# EAGLE schematic clock12 (EAGLE 7.7.0)

## Sheet 1 of 3
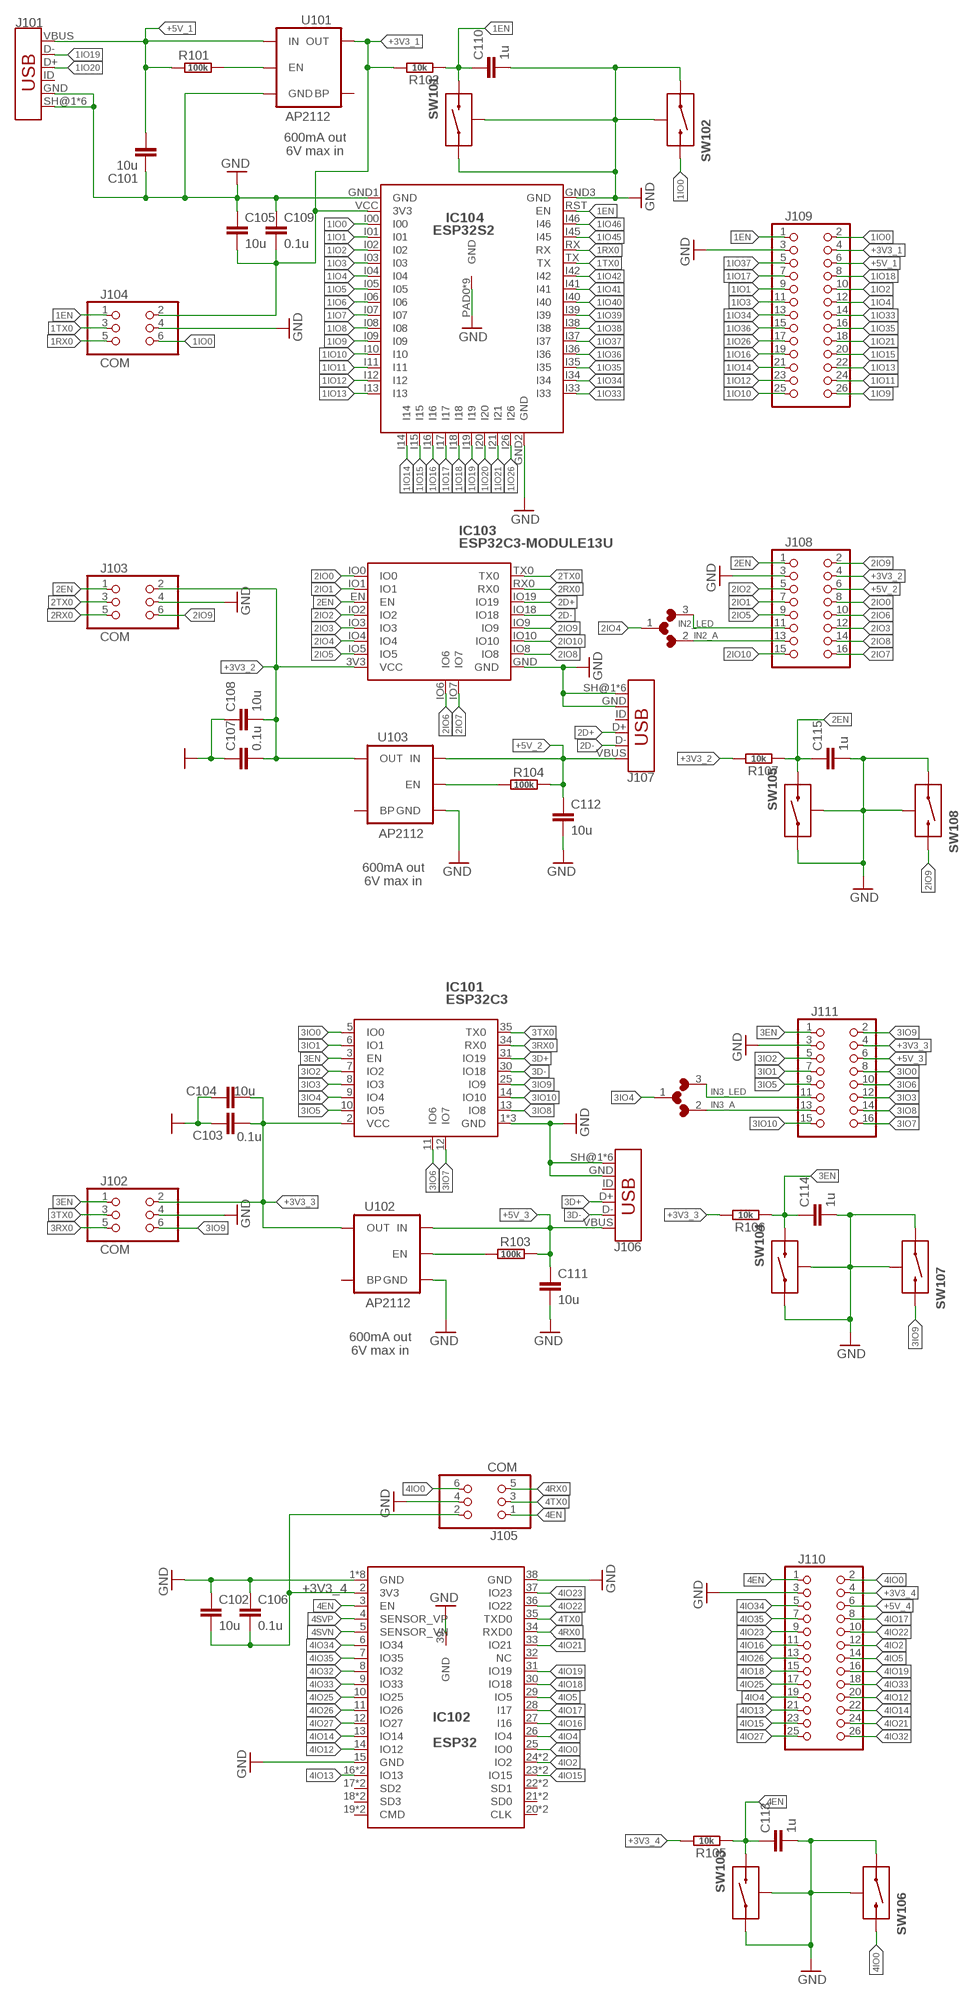
[diagram p0: schematic, sheet 1]

### Parts
C101  10u  CAP0603-CAP  [0603-CAP]
C102  10u  CAP0603-CAP  [0603-CAP]
C103  0.1u  CAP0603-CAP  [0603-CAP]
C104  10u  CAP0603-CAP  [0603-CAP]
C105  10u  CAP0603-CAP  [0603-CAP]
C106  0.1u  CAP0603-CAP  [0603-CAP]
C107  0.1u  CAP0603-CAP  [0603-CAP]
C108  10u  CAP0603-CAP  [0603-CAP]
C109  0.1u  CAP0603-CAP  [0603-CAP]
C110  1u  CAP0603-CAP  [0603-CAP]
C111  10u  CAP0603-CAP  [0603-CAP]
C112  10u  CAP0603-CAP  [0603-CAP]
C113  1u  CAP0603-CAP  [0603-CAP]
C114  1u  CAP0603-CAP  [0603-CAP]
C115  1u  CAP0603-CAP  [0603-CAP]
IC101  ESP32C3  ESP32C3-MODULE32S  [ESP32C3-S]
IC102  ESP32  ESP32-MODULEDUAL  [ESP32-WROOVER/WROOM]
IC103  ESP32C3-MODULE13U  [ESP32C3-13U]
IC104  ESP32S2  ESP32S2-MODULEAI  [ESP-12K]
J101  USB_MICRO-BFEMALE_SMT_  [USB-B-MICRO-SMD_MY]
J102  COM  HEADER-2X3SMT  [2X03_SMT]
J103  COM  HEADER-2X3SMT  [2X03_SMT]
J104  COM  HEADER-2X3SMT  [2X03_SMT]
J105  COM  HEADER-2X3SMT  [2X03_SMT]
J106  USB_MICRO-BFEMALE_SMT_  [USB-B-MICRO-SMD_MY]
J107  USB_MICRO-BFEMALE_SMT_  [USB-B-MICRO-SMD_MY]
J108  HEADER-2X8  [2X8]
J109  HEADER-2X13  [2X13]
J110  HEADER-2X13  [2X13]
J111  HEADER-2X8  [2X8]
R101  100k  R-EU_R0603  [R0603]
R102  10k  R-EU_R0603  [R0603]
R103  100k  R-EU_R0603  [R0603]
R104  100k  R-EU_R0603  [R0603]
R105  10k  R-EU_R0603  [R0603]
R106  10k  R-EU_R0603  [R0603]
R107  10k  R-EU_R0603  [R0603]
SJ101  L/W  MICROBUILDER_SOLDERJUMPER3  [MICROBUILDER_SOLDERJUMPER_ARROW_NOPASTE_3]
SJ102  L/W  MICROBUILDER_SOLDERJUMPER3  [MICROBUILDER_SOLDERJUMPER_ARROW_NOPASTE_3]
SW101  RST  MICROSWITCH-BUTTON  [MICROPUSH-BUT_TOP]
SW102  PRG  MICROSWITCH-BUTTON  [MICROPUSH-BUT_TOP]
SW103  RST  MICROSWITCH-BUTTON  [MICROPUSH-BUT_TOP]
SW104  RST  MICROSWITCH-BUTTON  [MICROPUSH-BUT_TOP]
SW105  RST  MICROSWITCH-BUTTON  [MICROPUSH-BUT_TOP]
SW106  PRG  MICROSWITCH-BUTTON  [MICROPUSH-BUT_TOP]
SW107  PRG  MICROSWITCH-BUTTON  [MICROPUSH-BUT_TOP]
SW108  PRG  MICROSWITCH-BUTTON  [MICROPUSH-BUT_TOP]
U101  AP2112  V_REG_LDOSMD  [SOT23-5]
U102  AP2112  V_REG_LDOSMD  [SOT23-5]
U103  AP2112  V_REG_LDOSMD  [SOT23-5]

### Nets
1EN: C110.1 IC104.RST(EN) J104.1 J109.1 R102.1 SW101.B
1EN_P: R101.2 U101.3(EN)
1IO0: IC104.I00 J104.6 J109.2 SW102.B
1IO1: IC104.I01 J109.9
1IO2: IC104.I02 J109.10
1IO3: IC104.I03 J109.11
1IO4: IC104.I04 J109.12
1IO5: IC104.I05
1IO6: IC104.I06
1IO7: IC104.I07
1IO8: IC104.I08
1IO9: IC104.I09 J109.26
1IO10: IC104.I10 J109.25
1IO11: IC104.I11 J109.24
1IO12: IC104.I12 J109.23
1IO13: IC104.I13 J109.22
1IO14: IC104.I14 J109.21
1IO15: IC104.I15 J109.20
1IO16: IC104.I16 J109.19
1IO17: IC104.I17 J109.7
1IO18: IC104.I18 J109.8
1IO19: IC104.I19 J101.D-
1IO20: IC104.I20 J101.D+
1IO21: IC104.I21 J109.18
1IO26: IC104.I26 J109.17
1IO33: IC104.I33 J109.14
1IO34: IC104.I34 J109.13
1IO35: IC104.I35 J109.16
1IO36: IC104.I36 J109.15
1IO37: IC104.I37 J109.5
1IO38: IC104.I38
1IO39: IC104.I39
1IO40: IC104.I40
1IO41: IC104.I41
1IO42: IC104.I42
1IO45: IC104.I45
1IO46: IC104.I46
1RX0: IC104.RX J104.5
1TX0: IC104.TX J104.3
2D+: IC103.IO19 J107.D+
2D-: IC103.IO18 J107.D-
2EN: C115.1 IC103.EN J103.1 J108.1 R107.1 SW105.B
2EN_P: R104.2 U103.3(EN)
2IO0: IC103.IO0 J108.8
2IO1: IC103.IO1 J108.7
2IO2: IC103.IO2 J108.5
2IO3: IC103.IO3 J108.12
2IO4: IC103.IO4 SJ101.1
2IO5: IC103.IO5 J108.9
2IO6: IC103.IO6 J108.10
2IO7: IC103.IO7 J108.16
2IO8: IC103.IO8 J108.14
2IO9: IC103.IO9 J103.6 J108.2 SW108.B
2IO10: IC103.IO10 J108.15
2RX0: IC103.RX0 J103.5
2TX0: IC103.TX0 J103.3
3D+: IC101.31(IO19) J106.D+
3D-: IC101.30(IO18) J106.D-
3EN: C114.1 IC101.3(EN) J102.1 J111.1 R106.1 SW104.B
3EN_P: R103.2 U102.3(EN)
3IO0: IC101.5(IO0) J111.8
3IO1: IC101.6(IO1) J111.7
3IO2: IC101.7(IO2) J111.5
3IO3: IC101.8(IO3) J111.12
3IO4: IC101.9(IO4) SJ102.1
3IO5: IC101.10(IO5) J111.9
3IO6: IC101.11(IO6) J111.10
3IO7: IC101.12(IO7) J111.16
3IO8: IC101.13(IO8) J111.14
3IO9: IC101.25(IO9) J102.6 J111.2 SW107.B
3IO10: IC101.14(IO10) J111.15
3RX0: IC101.34(RX0) J102.5
3TX0: IC101.35(TX0) J102.3
4EN: C113.1 IC102.3(EN) J105.1 J110.1 R105.1 SW103.B
4IO0: IC102.25(IO0) J105.6 J110.2 SW106.B
4IO2: IC102.24(IO2) IC102.48(IO2) J110.12
4IO4: IC102.26(IO4) J110.19
4IO5: IC102.29(IO5) J110.14
4IO12: IC102.14(IO12) J110.20
4IO13: IC102.16(IO13) IC102.40(IO13) J110.21
4IO14: IC102.13(IO14) J110.22
4IO15: IC102.23(IO15) IC102.47(IO15) J110.23
4IO16: IC102.27(I16) J110.11
4IO17: IC102.28(I17) J110.8
4IO18: IC102.30(IO18) J110.15
4IO19: IC102.31(IO19) J110.16
4IO21: IC102.33(IO21) J110.24
4IO22: IC102.36(IO22) J110.10
4IO23: IC102.37(IO23) J110.9
4IO25: IC102.10(IO25) J110.17
4IO26: IC102.11(IO26) J110.13
4IO27: IC102.12(IO27) J110.25
4IO32: IC102.8(IO32) J110.26
4IO33: IC102.9(IO33) J110.18
4IO34: IC102.6(IO34) J110.5
4IO35: IC102.7(IO35) J110.7
4RX0: IC102.34(RXD0) J105.5
4SVN: IC102.5(SENSOR_VN)
4SVP: IC102.4(SENSOR_VP)
4TX0: IC102.35(TXD0) J105.3
+3V3_1: C105.2 C109.2 IC104.VCC(3V3) J104.2 J109.4 R102.2 U101.5(OUT)
+3V3_2: C107.2 C108.2 IC103.3V3(VCC) J103.2 J108.4 R107.2 U103.5(OUT)
+3V3_3 [power]: C103.2 C104.2 IC101.2(VCC) J102.2 J111.4 R106.2 U102.5(OUT)
+3V3_4: C102.2 C106.2 IC102.2(3V3) J105.2 J110.4 R105.2
+5V_1: C101.1 J101.VBUS J109.6 R101.1 U101.1(IN)
+5V_2: C112.1 J107.VBUS J108.6 R104.1 U103.1(IN)
+5V_3 [power]: C111.1 J106.VBUS J111.6 R103.1 U102.1(IN)
+5V_4: J110.6
GND: C101.2 C102.1 C103.1 C104.1 C105.1 C106.1 C107.1 C108.1 C109.1 C110.2 C111.2 C112.2 C113.2 C114.2 C115.2 IC101.1(GND) IC101.38(GND) IC101.39(GND) IC102.1(GND) IC102.15(GND) IC102.38(GND) IC102.39(GND) IC102.GND IC102.PAD$1(GND) IC102.PAD$4(GND) IC102.PAD$5(GND) IC102.PAD$7(GND) IC102.PAD$8(GND) IC102.PAD$9(GND) IC103.GND IC104.GND1(GND) IC104.GND2(GND) IC104.GND3(GND) IC104.PAD0(GND) IC104.PAD1(GND) IC104.PAD2(GND) IC104.PAD3(GND) IC104.PAD4(GND) IC104.PAD5(GND) IC104.PAD6(GND) IC104.PAD7(GND) IC104.PAD8(GND) J101.GND J101.SH@1(SHIELD) J101.SH@2(SHIELD) J101.SH@3(SHIELD) J101.SH@4(SHIELD) J101.SH@5(SHIELD) J101.SH@6(SHIELD) J102.4 J103.4 J104.4 J105.4 J106.GND J106.SH@1(SHIELD) J106.SH@2(SHIELD) J106.SH@3(SHIELD) J106.SH@4(SHIELD) J106.SH@5(SHIELD) J106.SH@6(SHIELD) J107.GND J107.SH@1(SHIELD) J107.SH@2(SHIELD) J107.SH@3(SHIELD) J107.SH@4(SHIELD) J107.SH@5(SHIELD) J107.SH@6(SHIELD) J108.3 J109.3 J110.3 J111.3 SW101.A SW101.SH0(SH) SW102.A SW102.SH0(SH) SW103.A SW103.SH0(SH) SW104.A SW104.SH0(SH) SW105.A SW105.SH0(SH) SW106.A SW106.SH0(SH) SW107.A SW107.SH0(SH) SW108.A SW108.SH0(SH) U101.2(GND) U102.2(GND) U103.2(GND) ; also sheet 2,3
IN2_A: J108.13 SJ101.2
IN2_LED: J108.11 SJ101.3
IN3_A: J111.13 SJ102.2
IN3_LED: J111.11 SJ102.3
Unconnected: IC102.17(SD2) IC102.18(SD3) IC102.19(CMD) IC102.20(CLK) IC102.21(SD0) IC102.22(SD1) IC102.32(NC) IC102.41(SD2) IC102.42(SD3) IC102.43(CMD) IC102.44(CLK) IC102.45(SD0) IC102.46(SD1) J101.ID J106.ID J107.ID U101.4(BP) U102.4(BP) U103.4(BP)

### Notes on the sheet
- 600mA out
  6V max in
- 600mA out
  6V max in
- 600mA out
  6V max in

## Sheet 2 of 3
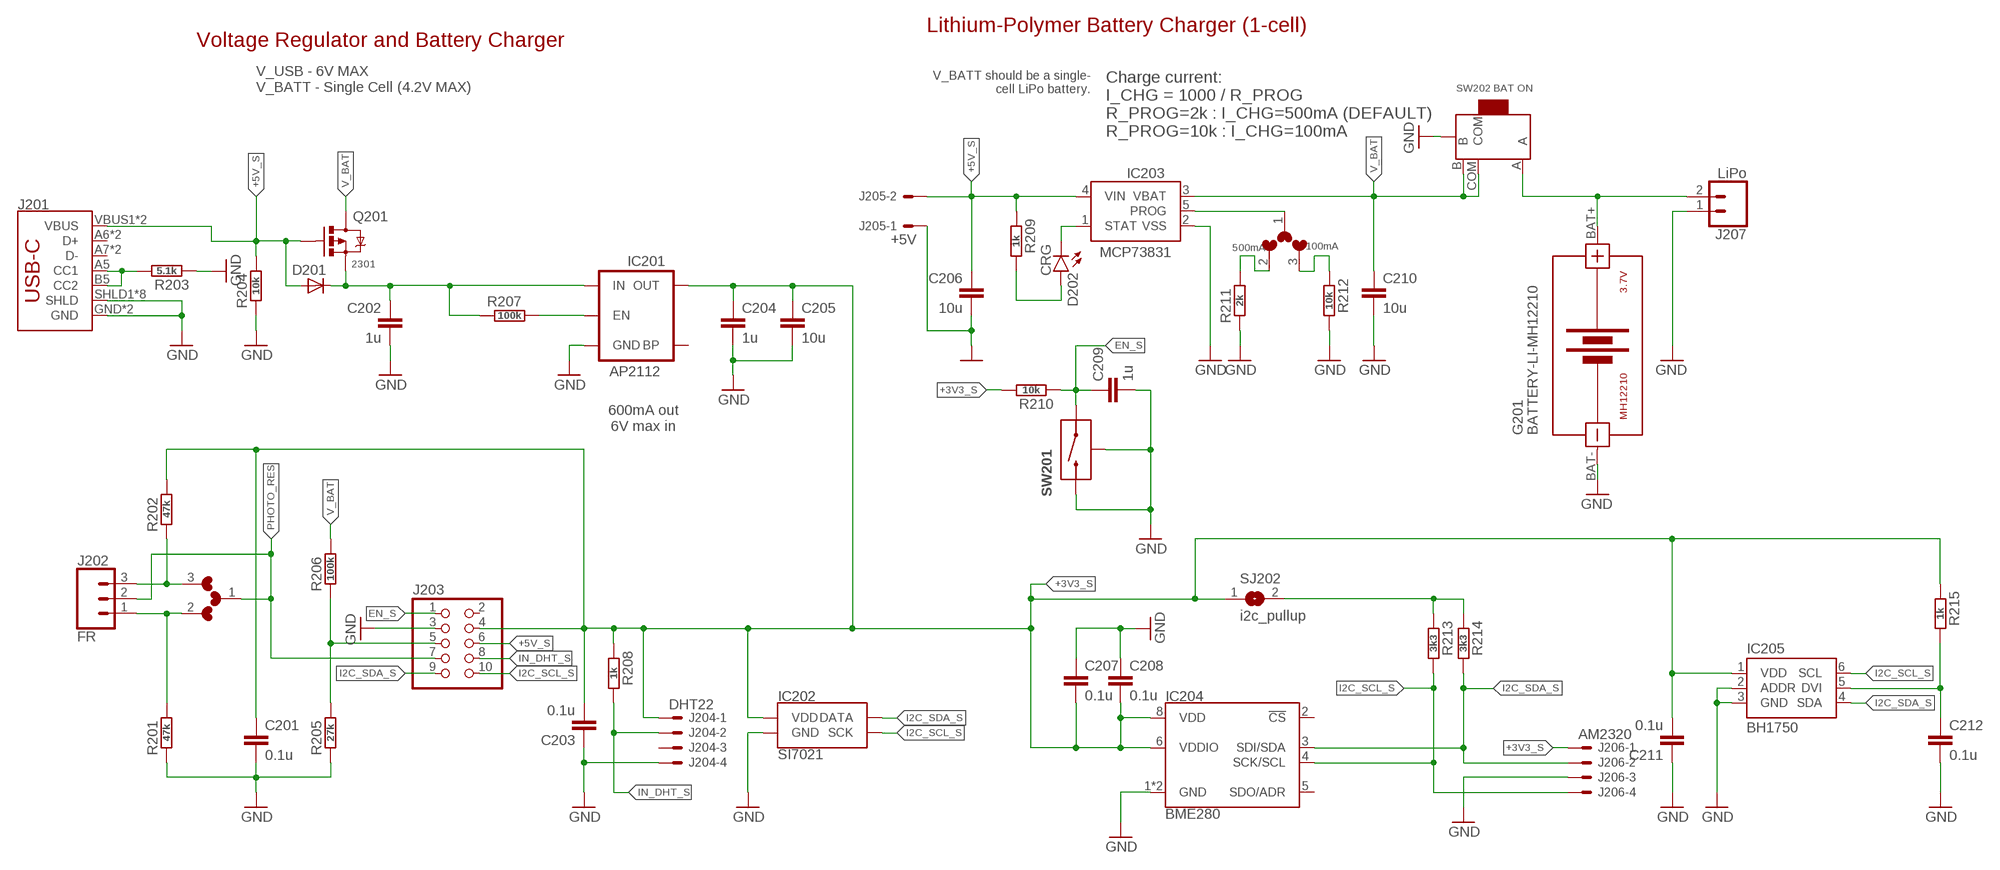
[diagram p1: schematic, sheet 2]

### Parts
C201  0.1u  CAP0603-CAP  [0603-CAP]
C202  1u  CAP0603-CAP  [0603-CAP]
C203  0.1u  CAP0603-CAP  [0603-CAP]
C204  1u  CAP0603-CAP  [0603-CAP]
C205  10u  CAP0603-CAP  [0603-CAP]
C206  10u  CAP0603-CAP  [0603-CAP]
C207  0.1u  CAP0603-CAP  [0603-CAP]
C208  0.1u  CAP0603-CAP  [0603-CAP]
C209  1u  CAP0603-CAP  [0603-CAP]
C210  10u  CAP0603-CAP  [0603-CAP]
C211  0.1u  CAP0603-CAP  [0603-CAP]
C212  0.1u  CAP0603-CAP  [0603-CAP]
D201  1N5819  DIODE-SOD123  [SOD123]
D202  CRG  LED-YELLOW0603  [LED-0603]
G201  BATTERY-LI-MH12210  [BATTERY-LI-MH12210]
IC201  AP2112  V_REG_LDOSMD  [SOT23-5]
IC202  SI7021  [DFN-6-3X3-SI7021]
IC203  MCP73831  [SOT23-5]
IC204  BME280  [LGA-8-2.5X2.5]
IC205  BH1750  [WSOF6L]
J201  USB_C16PIN  [USB-C-16P]
J202  FR  CONN_03  [1X03]
J203  HEADER-2X5  [2X05]
J204  DHT22  C-GRID-04-70543  [70543-04]
J205  +5V  C-GRID-02-70543  [70543-02]
J206  AM2320  C-GRID-04-70543  [70543-04]
J207  LiPo  CONN_02-JST-2MM-SMT  [JST-2-SMD]
Q201  2301  MOSFET-PCHANNELDMG2307L  [SOT23-3@1]
R201  47k  R-EU_R0603  [R0603]
R202  47k  R-EU_R0603  [R0603]
R203  5.1k  R-EU_R0603  [R0603]
R204  10k  R-EU_R0603  [R0603]
R205  27k  R-EU_R0603  [R0603]
R206  100k  R-EU_R0603  [R0603]
R207  100k  R-EU_R0603  [R0603]
R208  1k  R-EU_R0603  [R0603]
R209  1k  R-EU_R0603  [R0603]
R210  10k  R-EU_R0603  [R0603]
R211  2k  R-EU_R0603  [R0603]
R212  10k  R-EU_R0603  [R0603]
R213  3k3  R-EU_R0603  [R0603]
R214  3k3  R-EU_R0603  [R0603]
R215  1k  R-EU_R0603  [R0603]
SJ201  PR NEG/POS  MICROBUILDER_SOLDERJUMPER3  [MICROBUILDER_SOLDERJUMPER_ARROW_NOPASTE_3]
SJ202  i2c_pullup  MICROBUILDER_SOLDERJUMPER  [MICROBUILDER_SOLDERJUMPER_ARROW_NOPASTE]
SJ203  1/5  MICROBUILDER_SOLDERJUMPER3  [MICROBUILDER_SOLDERJUMPER_ARROW_NOPASTE_3]
SW201  MICROSWITCH-BUTTONANGLE  [MICROPUSH-BUT_ANG]
SW202  BAT ON  SMD-TOGGLE-SWITCH-ON-ON(3+4P-6.7X2.7MM)ORIG  [SWITCH-SMD-L6.7X2.7X3.2MM]

### Nets
+3V3_S: C201.1 C203.2 C204.1 C205.1 C207.2 C208.2 C211.2 IC201.5(OUT) IC202.VDD IC204.6(VDDIO) IC204.8(VDD) IC205.1(VDD) J203.4 J204.1 J206.1 R202.2 R208.1 R210.2 R215.1 SJ202.1
+5V: C202.1 D201.C IC201.1(IN) Q201.2(S) R207.1
+5V_S: C206.1 D201.A IC203.4(VIN) J201.VBUS1(VBUS) J201.VBUS2(VBUS) J203.6 J205.2 Q201.1(G) R204.2 R209.1
CHG: D202.C IC203.1(STAT)
EN_S: C209.1 J203.1 R210.1 SW201.A
EN_S_P: IC201.3(EN) R207.2
GND: C201.2 C202.2 C203.1 C204.2 C205.2 C206.2 C207.1 C208.1 C209.2 C210.2 C211.1 C212.2 G201.BAT- IC201.2(GND) IC202.GND IC203.2(VSS) IC204.1(GND) IC204.7(GND) IC205.2(ADDR) IC205.3(GND) J201.GND J201.GND2(GND) J201.SHLD1(SHLD) J201.SHLD2(SHLD) J201.SHLD3(SHLD) J201.SHLD4(SHLD) J201.SHLD5(SHLD) J201.SHLD6(SHLD) J201.SHLD7(SHLD) J201.SHLD8(SHLD) J203.3 J204.4 J205.1 J206.3 J207.1 R201.1 R203.1 R204.1 R205.1 R211.1 R212.2 SW201.B SW201.SH0(SH) SW201.SH3(SH) SW202.SS1(GND1) SW202.SS2(GND1) SW202.SS3(GND1) SW202.SS4(GND1) ; also sheet 1,3
I2C_SCL_S: IC202.SCK IC204.4(SCK/SCL) IC205.6(SCL) J203.10 J206.4 R213.2
I2C_SDA_S: IC202.DATA IC204.3(SDI/SDA) IC205.4(SDA) J203.9 J206.2 R214.2
IN_DHT_S: J203.8 J204.2 R208.2
N$1: D202.A R209.2
N$2: R211.2 SJ203.2
N$3: R213.1 R214.1 SJ202.2
N$4: J203.5 R205.2 R206.1
N$5: G201.BAT+ J207.2 SW202.A
N$7: J202.3 R202.1 SJ201.3
N$9: IC203.5(PROG) SJ203.1
N$10: J202.1 R201.2 SJ201.2
N$11: R212.1 SJ203.3
N$14: J201.A5(CC1) J201.B5(CC2) R203.2
N$25: C212.1 IC205.5(DVI) R215.2
PHOTO_RES: J202.2 J203.7 SJ201.1
V_BAT: C210.1 IC203.3(VBAT) Q201.3(D) R206.2 SW202.B SW202.COM
Unconnected: IC201.4(BP) IC204.2(!CS) IC204.5(SDO/ADR) J201.A6(D+) J201.A7(D-) J201.B6(D+) J201.B7(D-) J203.2 J204.3

### Notes on the sheet
- Lithium-Polymer Battery Charger (1-cell)
- Voltage Regulator and Battery Charger
- V_BATT should be a single-
  cell LiPo battery.
- V_USB - 6V MAX
  V_BATT - Single Cell (4.2V MAX)
- Charge current:
  I_CHG = 1000 / R_PROG
  R_PROG=2k : I_CHG=500mA (DEFAULT)
  R_PROG=10k : I_CHG=100mA
- 500mA | 100mA
- 600mA out
  6V max in

## Sheet 3 of 3
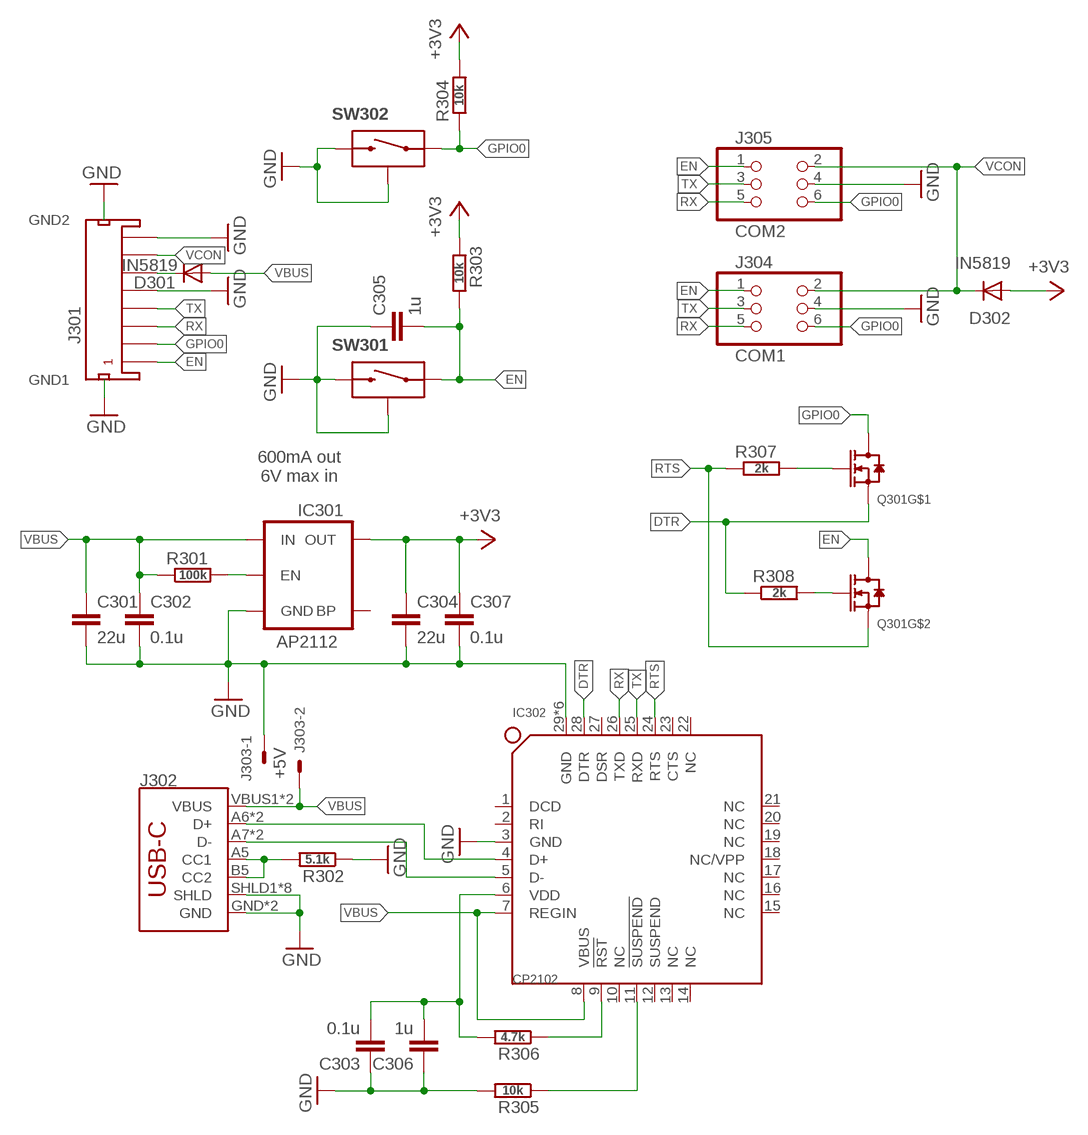
[diagram p2: schematic, sheet 3]

### Parts
C301  22u  CAP0603-CAP  [0603-CAP]
C302  0.1u  CAP0603-CAP  [0603-CAP]
C303  0.1u  CAP0603-CAP  [0603-CAP]
C304  22u  CAP0603-CAP  [0603-CAP]
C305  1u  CAP0603-CAP  [0603-CAP]
C306  1u  CAP0603-CAP  [0603-CAP]
C307  0.1u  CAP0603-CAP  [0603-CAP]
D301  IN5819  DIODE-SOD123  [SOD123]
D302  IN5819  DIODE-SOD123  [SOD123]
IC301  AP2112  V_REG_LDOSMD  [SOT23-5]
IC302  CP2102  CP2102-GMR(QFN28)  [QFN28G_0.5-5X5MM]
J301  PROG  JST-SH-1MM-8  [JST-SH-8-SMT-1MM]
J302  USB_C16PIN  [USB-C-16P]
J303  +5V  C-GRID-02-70543  [70543-02]
J304  COM1  HEADER-2X3SMT_1.27  [2X03_1.27MM_SMT]
J305  COM2  HEADER-2X3SMT  [2X03_SMT]
Q301  SMD-MOSFET-DUAL-N-CH-30V-2.9A-SI5902DC-T1-E3(1206-8)SOT363  [SOT363_PHILIPS]
R301  100k  R-EU_R0603  [R0603]
R302  5.1k  R-EU_R0603  [R0603]
R303  10k  R-EU_R0603  [R0603]
R304  10k  R-EU_R0603  [R0603]
R305  10k  R-EU_R0603  [R0603]
R306  4.7k  R-EU_R0603  [R0603]
R307  2k  R-EU_R0603  [R0603]
R308  2k  R-EU_R0603  [R0603]
SW301  RST  MICROSWITCH-BUTTON  [MICROPUSH-BUT_TOP]
SW302  PRG  MICROSWITCH-BUTTON  [MICROPUSH-BUT_TOP]

### Nets
+3V3: C304.1 C307.1 D302.A IC301.5(OUT) R303.1 R304.2
+3V3_CP: C303.2 C306.2 IC302.6(VDD) R306.2
D+: IC302.4(D+) J302.A6(D+) J302.B6(D+)
D-: IC302.5(D-) J302.A7(D-) J302.B7(D-)
DTR: IC302.28(DTR) Q301.1(S) R308.1
EN: C305.2 J301.P$1 J304.1 J305.1 Q301.3(D) R303.2 SW301.A
EN_S_P1: IC301.3(EN) R301.2
GND: C301.2 C302.2 C303.1 C304.2 C305.1 C306.1 C307.2 IC301.2(GND) IC302.3(GND) IC302.29(GND) IC302.HG1(GND) IC302.HG2(GND) IC302.HG3(GND) IC302.HG4(GND) IC302.HG5(GND) J301.P$5 J301.P$8 J301.P$9(GND1) J301.P$10(GND2) J302.GND J302.GND2(GND) J302.SHLD1(SHLD) J302.SHLD2(SHLD) J302.SHLD3(SHLD) J302.SHLD4(SHLD) J302.SHLD5(SHLD) J302.SHLD6(SHLD) J302.SHLD7(SHLD) J302.SHLD8(SHLD) J303.1 J304.4 J305.4 R302.1 R305.2 SW301.B SW301.SH0(SH) SW302.B SW302.SH0(SH) ; also sheet 1,2
GPIO0: J301.P$2 J304.6 J305.6 Q301.6(D) R304.1 SW302.A
N$8: D301.C J301.P$6
N$13: J302.A5(CC1) J302.B5(CC2) R302.2
N$19: Q301.2(G) R307.2
N$24: Q301.5(G) R308.2
N$33: IC302.11(!SUSPEND) R305.1
N$36: IC302.9(!RST) R306.1
RTS: IC302.24(RTS) Q301.4(S) R307.1
RX: IC302.26(TXD) J301.P$3 J304.5 J305.5
TX: IC302.25(RXD) J301.P$4 J304.3 J305.3
VBUS: C301.1 C302.1 D301.A IC301.1(IN) IC302.7(REGIN) IC302.8(VBUS) J302.VBUS1(VBUS) J302.VBUS2(VBUS) J303.2 R301.1
VCON: D302.C J301.P$7 J304.2 J305.2
Unconnected: IC301.4(BP) IC302.1(DCD) IC302.2(RI) IC302.10(NC) IC302.12(SUSPEND) IC302.13(NC) IC302.14(NC) IC302.15(NC) IC302.16(NC) IC302.17(NC) IC302.18(NC/VPP) IC302.19(NC) IC302.20(NC) IC302.21(NC) IC302.22(NC) IC302.23(CTS) IC302.27(DSR)

### Notes on the sheet
- 600mA out
  6V max in

## Library data of the parts
C101-C115 C201-C212 C301-C307 = radiva5:CAP: Capacitor Standard 0603 ceramic capacitor, and 0.1" leaded capacitor.
D201 D301 D302 = radiva5:DIODE-: DIODE
D202 = SparkFun-LED:LED-YELLOW: Yellow SMD LED Used in manufacturing several products at SparkFun. Packages: 0603 - SMD 0603 package[Product Link] <http://www.kingbrightusa.com/product.asp?catalog_name=LED&product_id=APT1608SYCK> 0603 -SMART - SMART SMD 0603 package (more efficient/more expensive) [Product Link] <http://www.osram-os.com/osram_os/en/products/product-catalog/led-light-emitting-diodes/smartled-0603/ly-l29k/index.jsp> LilyPad - SMD1206 package[Product Datasheet] <https://www.sparkfun.com/datasheets/DevTools/LilyPad/Q150YUS4.pdf> SparkFun Products: Blynk Board <https://www.sparkfun.com/products/13794> IOIO-OTG <https://www.sparkfun.com/products/13613> XBee Explorer Serial <https://www.sparkfun.com/products/13225>; PROD_ID: DIO-09003; VALUE: Yellow
G201 = diy-modules:BATTERY-LI-MH12210: Lithium-Ion MH12210 Rechargeable Battery Panasonic NCR18650PF battery datasheet available here: https://industrial.panasonic.com/cdbs/www-data/pdf2/ACI4000/ACI4000C12.pdf Click here to find device on ebay.com <http://www.ebay.com/sch/ncr18650b+battery>
IC101 IC103 = radiva5:ESP32C3-MODULE
IC102 = radiva5:ESP32-MODULE
IC104 = radiva5:ESP32S2-MODULE
IC201 IC301 = radiva5:V_REG_LDO: Voltage Regulator LDO Standard 150mA LDO voltage regulator in SOT-23 layout. Micrel part MIC5205. BP (by-pass) pin is used to lower output noise with 470pF cap.; PROD_ID: VREG-12457
IC202 = radiva5:SI7021: Silicon Labs Si7021 I2C Humidity and Temperature Sensor The Si7021 is a low-cost, easy-to-use, highly accurate, digital humidity and temperature sensor. This sensor is ideal for environmental sensing and data logging and perfect for build a weather stations or humidor control system. All you need are two lines for I2C communication, and you’ll have relative humidity readings and very accurate temperature readings as a bonus! Datasheet <https://cdn.sparkfun.com/datasheets/Sensors/Weather/Si7021.pdf> SparkFun Products SparkFun Humidity and Temperature Sensor Breakout - Si7021 <https://www.sparkfun.com/products/13763> (SEN-13763) SparkFun Blynk Board - ESP8266 <https://www.sparkfun.com/products/13794> (WRL-13794); PROD_ID: IC-13093
IC203 = radiva5:MCP73831: Miniature single cell, fully integrated Li-Ion, Li-polymer charge management controller http://ww1.microchip.com/downloads/en/DeviceDoc/20001984g.pdf IC-09995; PROD_ID: IC-09995
IC204 = radiva5:BME280: Bosch BME280 – Combined Humidity and Pressure Sensor The BME280 is as combined digital humidity, pressure and temperature sensor based on proven sensing principles. The sensor module is housed in an extremely compact metal-lid LGA package with a footprint of only 2.5×2.5mm² with a height of 0.93mm. Its small dimensions and its low power consumption allow the implementation in battery driven devices such as handsets, GPS modules or watches. Datasheet <https://cdn.sparkfun.com/assets/learn_tutorials/4/1/9/BST-BME280_DS001-10.pdf> SparkFun Products SparkFun Atmospheric Sensor Breakout - BME280 <https://www.sparkfun.com/products/13676> (SEN-13676); PROD_ID: IC-13090
IC205 = radiva5:BH1750; PROD_ID: IC-13876; VALUE: ZOPT2201
IC302 = radiva5:CP2102-GMR(QFN28): 310070003; MPN: CP2102-GMR; VALUE: CP2102-GMR-QFN28
J101 J106 J107 = radiva5:USB_MICRO-B: USB Type Micro-B Connector Male/female and PTH/SMT variants SparkFun Products: SparkFun microB USB Breakout <?https://www.sparkfun.com/products/12035?> SparkFun USB microB Plug Breakout <?https://www.sparkfun.com/products/10031?> SparkFun ESP8266 Thing <?https://www.sparkfun.com/products/13231?>
J102-J105 J304 J305 = radiva5:HEADER-2X3: PIN HEADER
J108 J111 = radiva5:HEADER-2X8: PIN HEADER
J109 J110 = radiva5:HEADER-2X13: PIN HEADER
J201 J302 = radiva5:USB_C: USB Type C 16Pin Connector Super Speed pins not available on the 16-pin purely SMD connector so this part is best for USB 2.0 implementations. D1 and D2 are tied together enabling D+/- no matter which way the cable is plugged into the connector. The two channel configuration pins (CC1/2) are exposed. These are normally connected to ground via 5.1k resistors but can be reconfigured for high current/high power applications.; PROD_ID: CONN-14122
J202 = radiva5:CONN_03: Multi connection point. Often used as Generic Header-pin footprint for 0.1 inch spaced/style header connections On any of the 0.1 inch spaced packages, you can populate with these: Break Away Headers - Straight <https://www.sparkfun.com/products/116> (PRT-00116) Break Away Male Headers - Right Angle <https://www.sparkfun.com/products/553> (PRT-00553) Female Headers <https://www.sparkfun.com/products/115> (PRT-00115) Break Away Headers - Machine Pin <https://www.sparkfun.com/products/117> (PRT-00117) Break Away Female Headers - Swiss Machine Pin <https://www.sparkfun.com/products/743> (PRT-00743) Stackable Header - 3 Pin (Female, 0.1") <https://www.sparkfun.com/products/13875> (PRT-13875) For SCREWTERMINALS and SPRING TERMINALS visit here: Screw Terimnals on SparkFun.com <https://www.sparkfun.com/search/results?term=Screw+Terminals> (5mm/3.5mm/2.54mm spacing) This device is also useful as a general connection point to wire up your design to another part of your project. Our various solder wires solder well into these plated through hole pads. Hook-Up Wire - Assortment (Stranded, 22 AWG) <https://www.sparkfun.com/products/11375> (PRT-11375) Hook-Up Wire - Assortment (Solid Core, 22 AWG) <https://www.sparkfun.com/products/11367> (PRT-11367) View the entire wire category on our website here <https://www.sparkfun.com/categories/141> Special notes: Molex polarized connector foot print use with SKU : PRT-08232 with associated crimp pins and housings.; PROD_ID: XXX-00000; VALUE: 455-1750-1-ND
J203 = radiva5:HEADER-2X5: PIN HEADER
J204 J206 = con-molex:C-GRID-04: CONNECTOR wire to board 2.54 mm (0.100") pitch header; OC_FARNELL: unknown; OC_NEWARK: unknown
J205 J303 = con-molex:C-GRID-02: CONNECTOR wire to board 2.54 mm (0.100") pitch header; OC_FARNELL: unknown; OC_NEWARK: unknown
J207 = SparkFun-Connectors:CONN_02: Multi connection point. Often used as Generic Header-pin footprint for 0.1 inch spaced/style header connections On any of the 0.1 inch spaced packages, you can populate with these: Break Away Headers - Straight <https://www.sparkfun.com/products/116> (PRT-00116) Break Away Male Headers - Right Angle <https://www.sparkfun.com/products/553> (PRT-00553) Female Headers <https://www.sparkfun.com/products/115> (PRT-00115) Break Away Headers - Machine Pin <https://www.sparkfun.com/products/117> (PRT-00117) Break Away Female Headers - Swiss Machine Pin <https://www.sparkfun.com/products/743> (PRT-00743) For SCREWTERMINALS and SPRING TERMINALS visit here: Screw Terimnals on SparkFun.com <https://www.sparkfun.com/search/results?term=Screw+Terminals> (5mm/3.5mm/2.54mm spacing) This device is also useful as a general connection point to wire up your design to another part of your project. Our various solder wires solder well into these plated through hole pads. Hook-Up Wire - Assortment (Stranded, 22 AWG) <https://www.sparkfun.com/products/11375> (PRT-11375) Hook-Up Wire - Assortment (Solid Core, 22 AWG) <https://www.sparkfun.com/products/11367> (PRT-11367) View the entire wire category on our website here <https://www.sparkfun.com/categories/141> Special notes: Molex polarized connector foot print use with: PRT-08233 with associated crimp pins and housings. 2.54_SCREWTERM for use with PRT-10571. 3.5mm Screw Terminal footprints for PRT-08084 5mm Screw Terminal footprints for use with PRT-08432; PROD_ID: CONN-11443
J301 = radiva5:JST-SH-1MM-8
Q201 = SparkFun-DiscreteSemi:MOSFET-PCHANNEL: Generic PMOSFET IRLML2244 - TRANS-11153 (SOT-23 -20V -4.3A) (1.Gate 2.Source 3.Drain) FQP27P06 - COM-10349 <http://www.sparkfun.com/products/10349> (TO-220 -60V -27A) (1.Gate 2.Source 3.Drain); PROD_ID: TRANS-11308; VALUE: 2.5A/30V
Q301 = radiva5:SMD-MOSFET-DUAL-N-CH-30V-2.9A-SI5902DC-T1-E3(1206-8): 305040005
R101-R107 R201-R215 R301-R308 = radiva5:R-EU_: RESISTOR, European symbol
SJ101 SJ102 SJ201 SJ203 = radiva5:MICROBUILDER_SOLDERJUMPER3: SMD Solder JUMPER Solder the two pads together to create a connection, or remove the solder to break it. REFLOW - Use this footprint for solder paste and reflow ovens. WAVE - Use this footprint for hand-soldering (larger pads). CLOSED - Has a trace between the two pads to ensure it is closed by default. The trace needs to be cut to disable the jumper, and can be closed again by creating a solder bridge between the two pads.
SJ202 = radiva5:MICROBUILDER_SOLDERJUMPER: SMD Solder JUMPER Solder the two pads together to create a connection, or remove the solder to break it. REFLOW - Use this footprint for solder paste and reflow ovens. WAVE - Use this footprint for hand-soldering (larger pads). CLOSED - Has a trace between the two pads to ensure it is closed by default. The trace needs to be cut to disable the jumper, and can be closed again by creating a solder bridge between the two pads.; BOM: EXCLUDE
SW101-SW108 SW201 SW301 SW302 = radiva5:MICROSWITCH-BUTTON
SW202 = radiva5:SMD-TOGGLE-SWITCH-ON-ON(3+4P-6.7X2.7MM): 311030001
U101-U103 = SparkFun-PowerIC:V_REG_LDO: Voltage Regulator LDO Standard 150mA LDO voltage regulator in SOT-23 layout. Micrel part MIC5205. BP (by-pass) pin is used to lower output noise with 470pF cap.; PROD_ID: VREG-12457

## Net classes
0 default: clearance 0.205 mm
1 power: width 0.406 mm